# Altium schematic sheet F103.SchDoc
size 287 x 202 mm
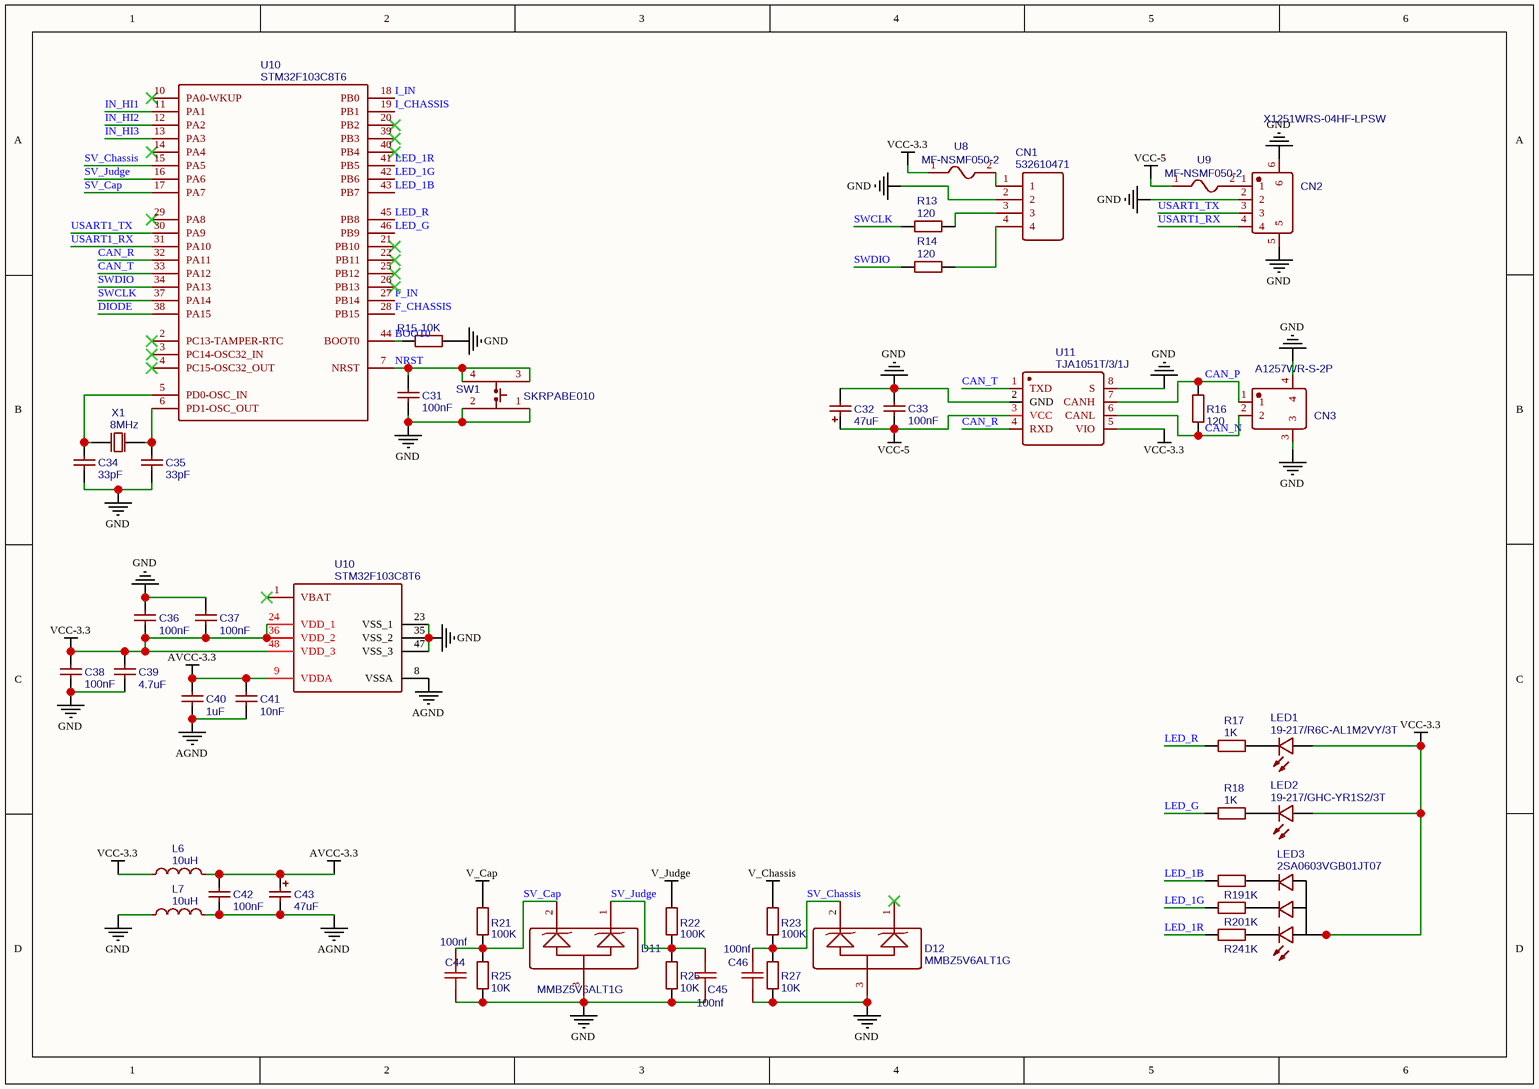
[diagram p0: F103.SchDoc]

## Parts
(Parts that share a designator on the sheet are numbered #1, #2 ... from top to bottom, then left to right.)
C31  100nF  [C0603]
C32  47uF  [CASE-A_3216]
C33  100nF  [R0603]
C34  33pF  [C0603]
C35  33pF  [C0603]
C36  100nF  [C0603]
C37  100nF  [C0603]
C38  100nF  [C0603]
C39  4.7uF  [C0805]
C40  1uF  [C0603]
C41  10nF  [C0603]
C42  100nF  [C0603]
C43  47uF  [CASE-A_3216]
C44  100nf  [C0603]
C45  100nf  [C0603]
C46  100nf  [C0603]
CN1  532610471  [SMD-10.15X4.8-4P]
CN2  X1251WRS-04HF-LPSW  [CONN-TH_4PIN-H-MALE-PITCH1.25-L_X1251WRS-04HF-LPSW]
CN3  A1257WR-S-2P  [CONN-SMD_A1257WR-S-2P]
D11  MMBZ5V6ALT1G  [SOT-23(SOT-23-3)]
D12  MMBZ5V6ALT1G  [SOT-23(SOT-23-3)]
L6  10uH  [L0603]
L7  10uH  [L0603]
LED1  19-217/R6C-AL1M2VY/3T  [LED-0603]
LED2  19-217/GHC-YR1S2/3T  [LED-0603]
LED3  2SA0603VGB01JT07  [LED-SMD_4PIN-L1.60-W1.60-TL-FD]
R13  120  [R0603]
R14  120  [R0603]
R15  10K  [R0603]
R16  120  [R0603]
R17  1K  [R0603]
R18  1K  [R0603]
R19  1K  [R0603]
R20  1K  [R0603]
R21  100K  [R0603]
R22  100K  [R0603]
R23  100K  [R0603]
R24  1K  [R0603]
R25  10K  [R0603]
R26  10K  [R0603]
R27  10K  [R0603]
SW1  SKRPABE010  [KEY-SMD-4P_L4.2-W3.2-H2.5]
U8  MF-NSMF050-2  [FUSE-1206]
U9  MF-NSMF050-2  [FUSE-1206]
U10#1  STM32F103C8T6  [LQFP-48_7X7X05P]
U10#2  STM32F103C8T6  [LQFP-48_7X7X05P]
U11  TJA1051T/3/1J  [SOIC-8_150MIL]
X1  8MHz  [SMD-5032_2P]

## Nets
AGND: C40.1 C41.1 C42.1 C43.2 L7.2 U10#2.8(VSSA)
AVCC-3.3: C40.2 C41.2 C42.2 C43.1 L6.2 U10#2.9(VDDA)
GND: C31.1 C32.2 C33.2 C34.1 C35.1 C36.1 C37.2 C38.1 C39.1 C44.1 C45.1 C46.1 CN1.2 CN2.2 CN2.5 CN2.6 CN3.3 CN3.4 D11.3(A) D12.3(A) L7.1 R15.1 R25.1 R26.1 R27.1 SW1.1 SW1.2 U10#2.23(VSS_1) U10#2.35(VSS_2) U10#2.47(VSS_3) U11.2(GND) U11.8(S)
V_Cap: R21.1
V_Chassis: R23.1
V_Judge: R22.1
VCC-3.3: C36.2 C37.1 C38.2 C39.2 L6.1 LED1.1(A) LED2.1(A) LED3.1(A) U8.1 U10#2.24(VDD_1) U10#2.36(VDD_2) U10#2.48(VDD_3) U11.5(VIO)
VCC-5: C32.1 C33.1 U9.1 U11.3(VCC)
BOOT0: R15.2 U10#1.44(BOOT0)
CAN_N: CN3.2 R16.2 U11.6(CANL)
CAN_P: CN3.1 R16.1 U11.7(CANH)
CAN_R: U10#1.32(PA11) U11.4(RXD)
CAN_T: U10#1.33(PA12) U11.1(TXD)
DIODE: U10#1.38(PA15)
F_CHASSIS: U10#1.28(PB15)
F_IN: U10#1.27(PB14)
I_CHASSIS: U10#1.19(PB1)
I_IN: U10#1.18(PB0)
IN_HI1: U10#1.11(PA1)
IN_HI2: U10#1.12(PA2)
IN_HI3: U10#1.13(PA3)
LED_1B: R19.1 U10#1.43(PB7)
LED_1G: R20.1 U10#1.42(PB6)
LED_1R: R24.1 U10#1.41(PB5)
LED_G: R18.1 U10#1.46(PB9)
LED_R: R17.1 U10#1.45(PB8)
NRST: C31.2 SW1.3 SW1.4 U10#1.7(NRST)
SV_Cap: C44.2 D11.2(C) R21.2 R25.2 U10#1.17(PA7)
SV_Chassis: C46.2 D12.2(C) R23.2 R27.2 U10#1.15(PA5)
SV_Judge: C45.2 D11.1(C) R22.2 R26.2 U10#1.16(PA6)
SWCLK: R13.2 U10#1.37(PA14)
SWDIO: R14.2 U10#1.34(PA13)
USART1_RX: CN2.4 U10#1.31(PA10)
USART1_TX: CN2.3 U10#1.30(PA9)
NetC34_2: C34.2 U10#1.5(PD0-OSC_IN) X1.1(OSC1)
NetC35_2: C35.2 U10#1.6(PD1-OSC_OUT) X1.2(OSC2)
NetCN1_1: CN1.1 U8.2
NetCN1_3: CN1.3 R13.1
NetCN1_4: CN1.4 R14.1
NetCN2_1: CN2.1 U9.2
NetLED1_2: LED1.2(C) R17.2
NetLED2_2: LED2.2(C) R18.2
NetLED3_2: LED3.2(R) R24.2
NetLED3_3: LED3.3(B) R19.2
NetLED3_4: LED3.4(G) R20.2

Not connected (* = marked no-connect by the designer): D12 1(C)*; U10#1 2(PC13-TAMPER-RTC)* 3(PC14-OSC32_IN)* 4(PC15-OSC32_OUT)* 10(PA0-WKUP)* 14(PA4)* 20(PB2)* 21(PB10)* 22(PB11)* 25(PB12)* 26(PB13)* 29(PA8)* 39(PB3)* 40(PB4)*; U10#2 1(VBAT)*

## Library data of the parts
C31 C33 C36-C38 C42 = 100nF: BOM_Manufacturer Part: CL05B104KO5NNNC; BOM_Manufacturer: SAMSUNG; nameAlias: Capacitance; BOM_Supplier: LCSC; BOM_LCSC Assembly: Yes; BOM_Supplier Part: C1525; spicePre: C; spiceSymbolName: CL05B104KO5NNNC
C32 C43 = 47uF: BOM_Manufacturer: Xiangyee; BOM_Manufacturer Part: CA45-A010K476T; nameAlias: Capacitance; Contributor: LCSC; BOM_Supplier: LCSC; BOM_Supplier Part: C127069; BOM_LCSC Assembly: Yes; spicePre: C; spiceSymbolName: CA45-A010K476T
C34 C35 = 33pF: BOM_Manufacturer Part: CL05C330JB5NNNC; BOM_Manufacturer: SAMSUNG; nameAlias: Capacitance; BOM_Supplier: LCSC; BOM_Supplier Part: C70465; spicePre: C; spiceSymbolName: CL05C330JB5NNNC
C39 = 4.7uF: BOM_Manufacturer Part: CL05A475MP5NRNC; BOM_Manufacturer: SAMSUNG; nameAlias: Capacitance; BOM_Supplier: LCSC; BOM_LCSC Assembly: Yes; BOM_Supplier Part: C23733; spicePre: C; spiceSymbolName: CL05A475MP5NRNC
C40 = 1uF: BOM_Manufacturer Part: CL10A105KB8NNNC; BOM_Manufacturer: SAMSUNG; nameAlias: Capacitance; BOM_Supplier: LCSC; BOM_LCSC Assembly: Yes; BOM_Supplier Part: C15849; spicePre: C; spiceSymbolName: CL10A105KB8NNNC
C41 = 10nF: BOM_Manufacturer Part: CL05B103KB5NNNC; BOM_Manufacturer: SAMSUNG; nameAlias: Capacitance; BOM_Supplier: LCSC; BOM_LCSC Assembly: Yes; BOM_Supplier Part: C15195; spicePre: C; spiceSymbolName: CL05B103KB5NNNC
C44-C46 = 100nf: nameAlias: Value(F); spicePre: C; spiceSymbolName: Cap_0402_US
CN1 = 532610471: BOM_Manufacturer: MOLEX; BOM_Supplier: LCSC; BOM_Manufacturer Part: 532610471; BOM_Supplier Part: C127368; spicePre: C
CN2 = X1251WRS-04HF-LPSW: BOM_Manufacturer: XKB Enterprise; Contributor: LCSC; BOM_Supplier: LCSC; BOM_Supplier Part: C388709; BOM_Manufacturer Part: X1251WRS-04HF-LPSW; spicePre: C; spiceSymbolName: X1251WRS-04HF-LPSW
CN3 = A1257WR-S-2P: BOM_Manufacturer: Changjiang Connectors; Contributor: LCSC; BOM_Supplier: LCSC; BOM_Supplier Part: C225125; BOM_Manufacturer Part: A1257WR-S-2P; spicePre: C; spiceSymbolName: A1257WR-S-2P
D11 D12 = MMBZ5V6ALT1G: BOM_Manufacturer: ON; Contributor: LCSC; BOM_Supplier: LCSC; BOM_Manufacturer Part: MMBZ5V6ALT1G; BOM_Supplier Part: C123251; BOM_LCSC Assembly: Yes; spicePre: D
L6 L7 = 10uH: BOM_Manufacturer: Sunlord; BOM_Manufacturer Part: SDFL2012S100KTF; nameAlias: Inductance; SMT Type: Basic; BOM_Supplier: LCSC; BOM_LCSC Assembly: Yes; BOM_Supplier Part: C1046; spicePre: L; spiceSymbolName: SDFL2012S100KTF
LED1 = 19-217/R6C-AL1M2VY/3T: BOM_Manufacturer: EVERLIGHT; BOM_Supplier: LCSC; BOM_Manufacturer Part: 19-217/R6C-AL1M2VY/3T; image: //image.lceda.cn/szlcsc/C72044.jpg; BOM_Supplier Part: C72044; BOM_LCSC Assembly: Yes; spicePre: L
LED2 = 19-217/GHC-YR1S2/3T: BOM_Manufacturer: EVERLIGHT; BOM_Supplier: LCSC; BOM_Manufacturer Part: 19-217/GHC-YR1S2/3T; BOM_LCSC Assembly: Yes; image: //image.lceda.cn/szlcsc/C72043.jpg; BOM_Supplier Part: C72043; spicePre: L
LED3 = 2SA0603VGB01JT07: BOM_Manufacturer: Brightek Optoelectronics; Contributor: LCSC; BOM_Supplier: LCSC; BOM_Supplier Part: C233195; BOM_Manufacturer Part: 2SA0603VGB01JT07; spicePre: L; spiceSymbolName: 2SA0603VGB01JT07
R13 R14 R16 = 120: BOM_Manufacturer: UniOhm; BOM_Manufacturer Part: 0402WGF1200TCE; nameAlias: Resistance (Ohms); BOM_Supplier: LCSC; BOM_LCSC Assembly: Yes; BOM_Supplier Part: C25079; spicePre: R; spiceSymbolName: 0402WGF1200TCE
R15 = 10K: BOM_Manufacturer: UniOhm; BOM_Manufacturer Part: 0402WGF1002TCE; nameAlias: Resistance (Ohms); BOM_Supplier: LCSC; BOM_LCSC Assembly: Yes; BOM_Supplier Part: C25744; spicePre: R; spiceSymbolName: 0402WGF1002TCE
R17-R20 R24 = 1K: BOM_Manufacturer: UniOhm; BOM_Manufacturer Part: 0402WGF1001TCE; nameAlias: Resistance (Ohms); SMT Type: Basic; BOM_Supplier: LCSC; BOM_LCSC Assembly: Yes; BOM_Supplier Part: C11702; spicePre: R; spiceSymbolName: 0402WGF1001TCE
R21-R23 = 100K: BOM_Manufacturer: UniOhm; BOM_Manufacturer Part: 0402WGF1002TCE; nameAlias: Resistance (Ohms); BOM_Supplier: LCSC; BOM_LCSC Assembly: Yes; BOM_Supplier Part: C25744; spicePre: R; spiceSymbolName: 0402WGF1002TCE
R25-R27 = 10K: BOM_Manufacturer: UniOhm; BOM_Manufacturer Part: 0402WGF1001TCE; nameAlias: Resistance (Ohms); SMT Type: Basic; BOM_Supplier: LCSC; BOM_LCSC Assembly: Yes; BOM_Supplier Part: C11702; spicePre: R; spiceSymbolName: 0402WGF1001TCE
SW1 = SKRPABE010: BOM_Manufacturer: ALPS; BOM_Supplier: LCSC; BOM_Manufacturer Part: SKRPABE010; BOM_Supplier Part: C115360; spicePre: S
U8 U9 = MF-NSMF050-2: BOM_Manufacturer: BOURNS; BOM_Supplier: LCSC; BOM_Manufacturer Part: MF-NSMF050-2; BOM_Supplier Part: C75464; BOM_LCSC Assembly: Yes; spicePre: U
U10#1 U10#2 = STM32F103C8T6: BOM_Manufacturer: ST; subpart_no: 1; tags: STM32; timeStamp: 1455028086; BOM_Supplier Part: C8734; BOM_Supplier: LCSC; BOM_Manufacturer Part: STM32F103C8T6; image: http://image.lceda.cn/szlcsc/C8734.jpg; spicePre: U
U11 = TJA1051T/3/1J: BOM_Manufacturer: NXP; BOM_Supplier: LCSC; BOM_Manufacturer Part: TJA1051T/3/1J; BOM_LCSC Assembly: Yes; image: //image.lceda.cn/szlcsc/C38695.jpg; BOM_Supplier Part: C38695; spicePre: U
X1 = 8MHz: BOM_Manufacturer: Yangxing Tech; BOM_Manufacturer Part: X50328MSD2GC; nameAlias: Frequency; Contributor: LCSC; BOM_Supplier: LCSC; BOM_Supplier Part: C172361; BOM_LCSC Assembly: Yes; spicePre: X; spiceSymbolName: X50328MSD2GC_C172361